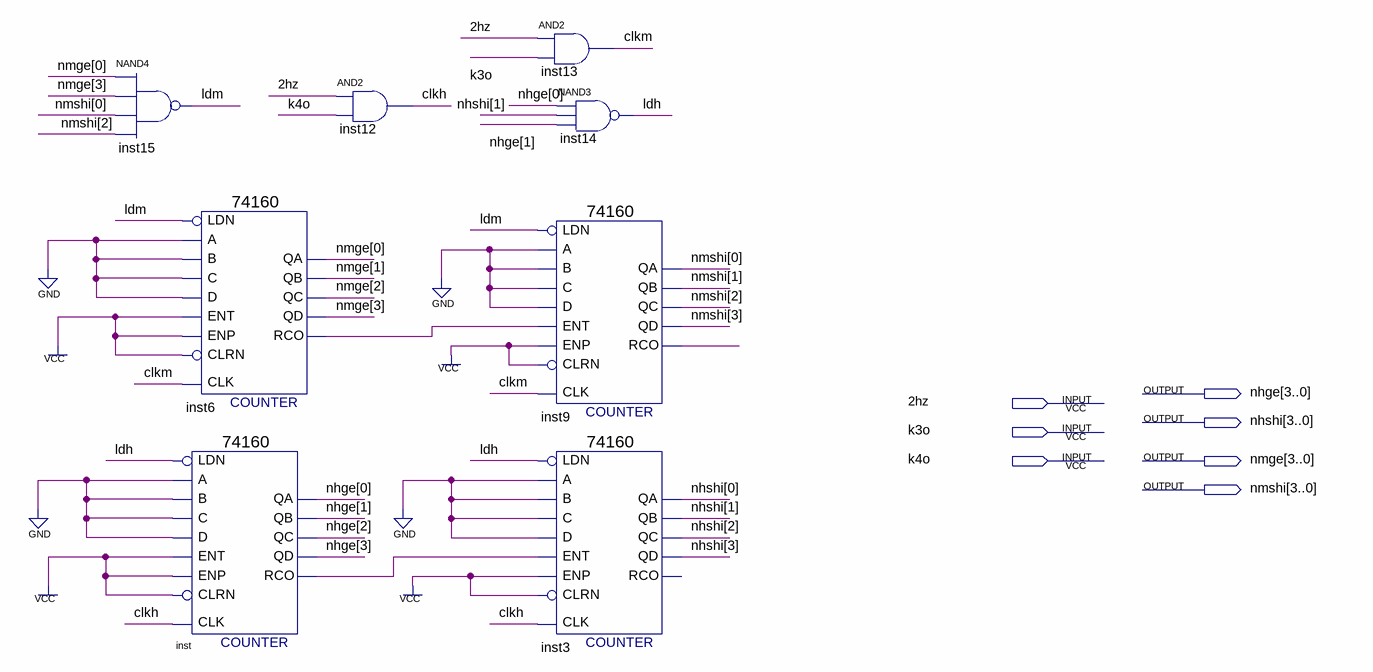
[diagram p0: schematic sheet]
// Quartus schematic dingshifen.bdf as structural Verilog: 8 symbols, 7 pins
module dingshifen (
  input  \2hz ,
  input  k3o,
  input  k4o,
  output [3:0] nhge,
  output [3:0] nhshi,
  output [3:0] nmge,
  output [3:0] nmshi
);

  wire clkh, clkm, inst6_rco, inst9_rco, inst_rco, ldh, ldm;

  nand inst15 (ldm, nmge[0], nmge[3], nmshi[0], nmshi[2]);
  \74160  inst6 (
    .CLK(clkm), .ENT(1'b1), .A(1'b0), .B(1'b0), .C(1'b0), .D(1'b0), .LDN(ldm), .ENP(1'b1), .CLRN(1'b1),
    .QD(nmge[3]), .QA(nmge[0]), .QB(nmge[1]), .QC(nmge[2]), .RCO(inst6_rco));
  \74160  inst (
    .CLK(clkh), .ENT(1'b1), .A(1'b0), .B(1'b0), .C(1'b0), .D(1'b0), .LDN(ldh), .ENP(1'b1), .CLRN(1'b1),
    .QD(nhge[3]), .QA(nhge[0]), .QB(nhge[1]), .QC(nhge[2]), .RCO(inst_rco));
  and inst12 (clkh, \2hz , k4o);
  and inst13 (clkm, \2hz , k3o);
  nand inst14 (ldh, nhge[0], nhshi[1], nhge[1]);
  \74160  inst9 (
    .CLK(clkm), .ENT(inst6_rco), .A(1'b0), .B(1'b0), .C(1'b0), .D(1'b0), .LDN(ldm), .ENP(1'b1), .CLRN(1'b1),
    .QD(nmshi[3]), .QA(nmshi[0]), .QB(nmshi[1]), .QC(nmshi[2]), .RCO(inst9_rco));
  \74160  inst3 (
    .CLK(clkh), .ENT(inst_rco), .A(1'b0), .B(1'b0), .C(1'b0), .D(1'b0), .LDN(ldh), .ENP(1'b1), .CLRN(1'b1),
    .QD(nhshi[3]), .QA(nhshi[0]), .QB(nhshi[1]), .QC(nhshi[2]));  // open: RCO
endmodule
